# Altium project RT_SUPER_HOST_A.PrjPcb
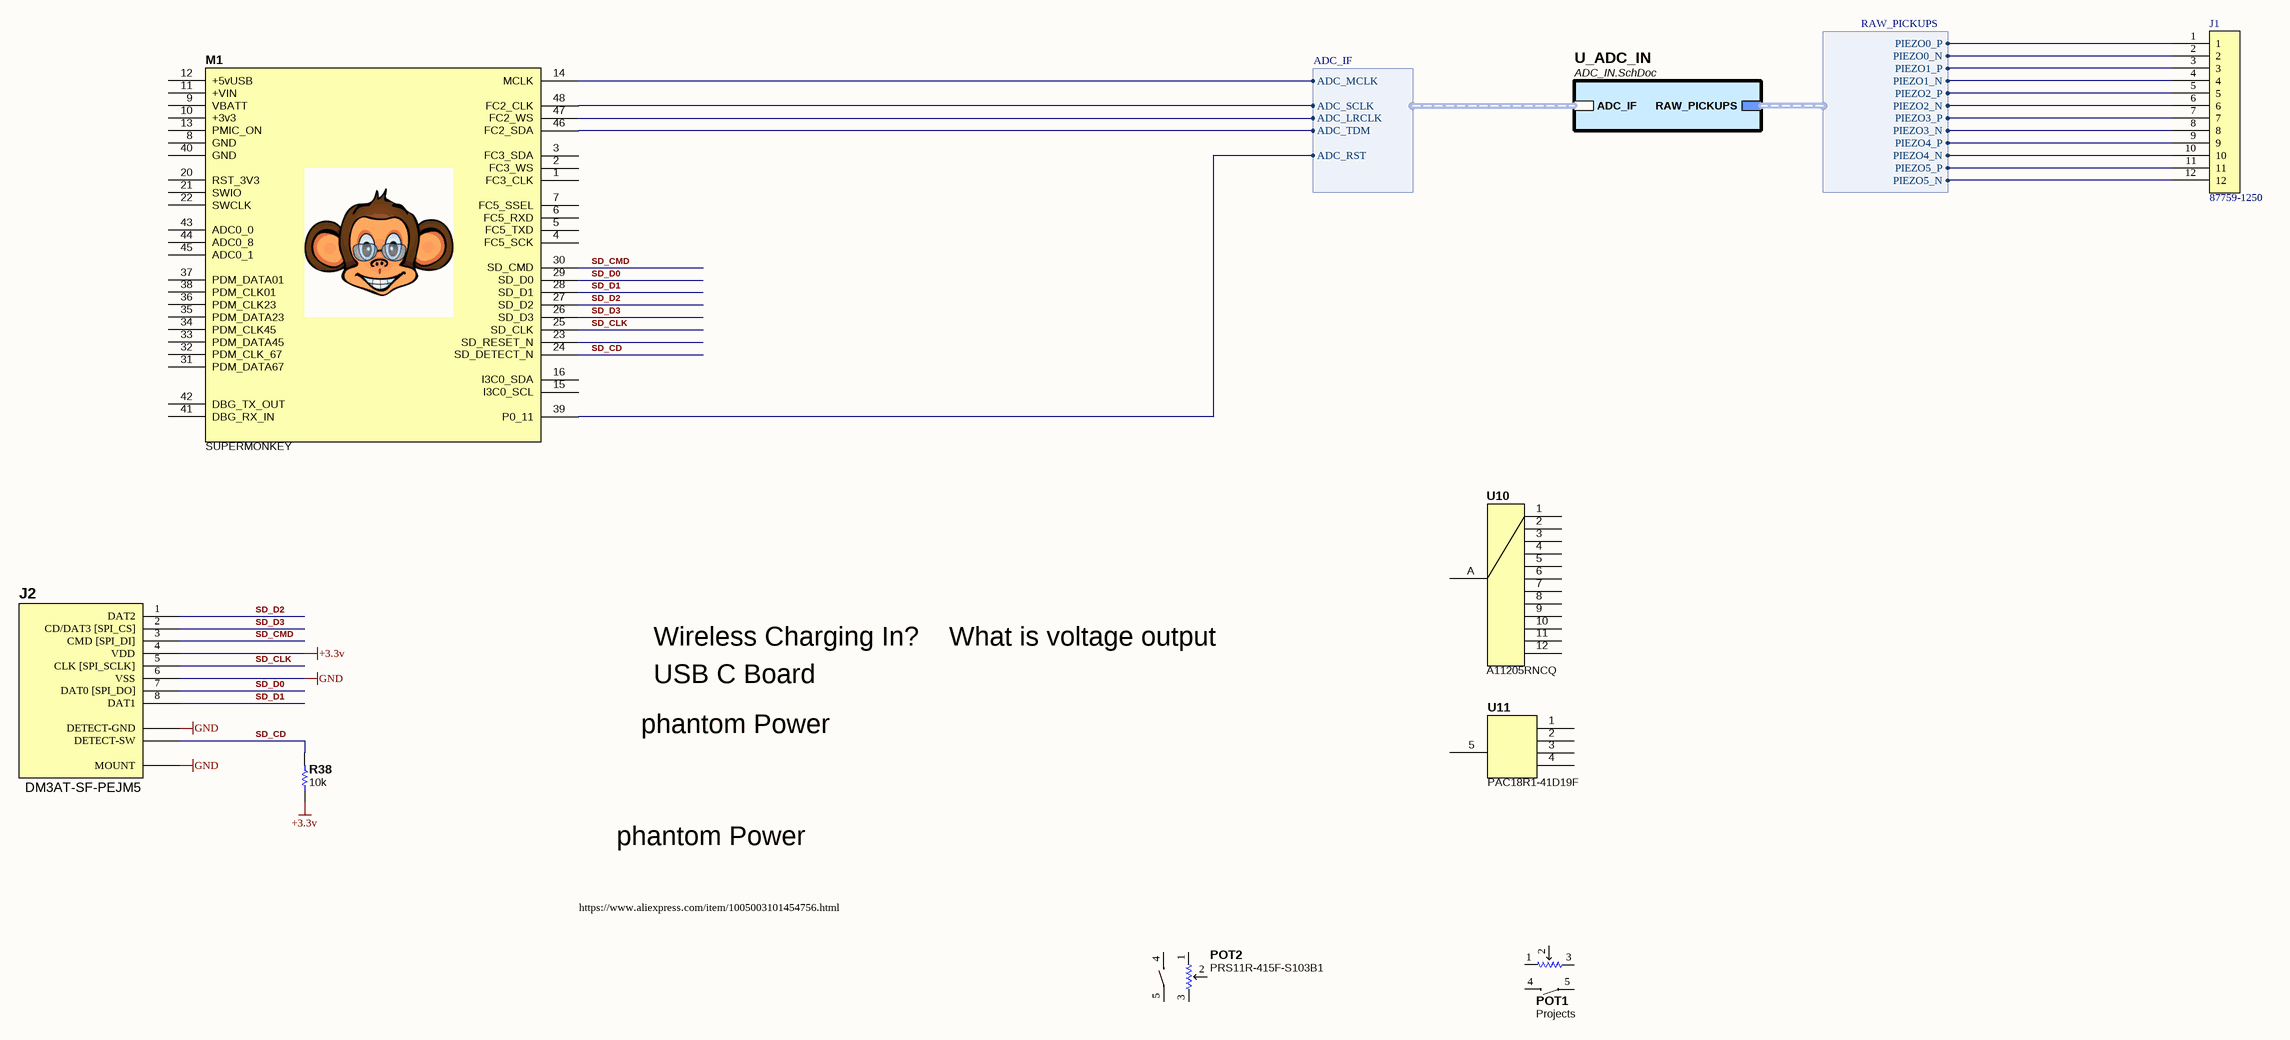
[diagram p0: RT_SUPER_HOST_A.SchDoc]
APPROVAL_APPROVED_1: -; APPROVAL_APPROVED_1_DATE: -; APPROVAL_APPROVED_2: -; APPROVAL_APPROVED_2_DATE: -; APPROVAL_CHECKED_DATE: -; APPROVAL_DRAWN: -; APPROVAL_DRAWN_DATE: -; APPROVAL_ENGINEER: -; APPROVAL_ENGINEER_DATE: -; APPROVAL_REVIEWED: -; APPROVAL_REVIEWED_DATE: -; BOM_NOTES_LINE_1: -; BOM_NOTES_LINE_2: -; BOM_NOTES_LINE_3: -; BOM_NOTES_LINE_4: -; CCA_PART_NUMBER: RT_SUPER; CCA_TITLE: RT_SUPER; PCB_COPPER_WEIGHT_INNER: 1oz; PCB_COPPER_WEIGHT_OUTER: 1oz; PCB_DRC_DATE: X; PCB_FINISH_PLATING: GOLD ENIG; PCB_FINISHED_THICKNESS: 31.25; PCB_LAYERS: 4; PCB_MATERIAL: FR4; PCB_MIN_DRILL: 6; PCB_MIN_TRACE_SPACE: 5; PCB_MIN_TRACE_WIDTH: 5; PCB_PART_NUMBER: RT_SUPER; PCB_PRINTOUT_SCALE: 1:1; PCB_SILKSCREEN_COLOR_BOTTOM: WHITE; PCB_SILKSCREEN_COLOR_TOP: WHITE; PCB_SOLDER_MASK_COLOR_BOTTOM: BLACK; PCB_SOLDER_MASK_COLOR_TOP: BLACK; PCB_TITLE: RT_SUPER; PCB_VERSION: B; PROJECT_ENGINEER: E. Hughes; PROJECT_STATUS: PROTOTYPE; PROJECT_TITLE_LINE_1: RT_SUPER; SCH_DATE: 2021-09-02
2 sheets, 98 parts. Net scope: hierarchical (ports join the sheet entries above them; power ports are global).
Board file: RT_SUPER_HOST_A.PCBdoc
Sheets:
  RT_SUPER_HOST_A.SchDoc
    U_ADC_IN = ADC_IN.SchDoc

## Sheet RT_SUPER_HOST_A.SchDoc
size D; Organization: Altium Limited; Address1: 3 Minna Close; Address2: Belrose; Address3: NSW 2085; Address4: Australia; DocumentNumber: 1; SheetNumber: 1; SheetTotal: 1; PAGE_TITLE: TOP LEVEL

### Parts
J1  87759-1250  [87759-1250]
J2  DM3AT-SF-PEJM5  [DM3AT-SF-PEJM5]
M1  SUPERMONKEY  [SUPERMONKEY]
POT1  Projects  [PRS11R420FS103B1]
POT2  PRS11R-415F-S103B1  [PRS11R415FS103B1]
R38  10k  [R0402_0.40MM_MD]
U10  A11205RNCQ  [A11205RNCQ]
U11  PAC18R1-41D19F  [PAC18R1]

### Sub-sheets
U_ADC_IN = ADC_IN.SchDoc: RAW_PICKUPS (harness RAW_PICKUPS), ADC_IF (harness ADC_IF)

### Harnesses
ADC_IF: ADC_MCLK, ADC_LRCLK, ADC_SCLK, ADC_TDM, ADC_RST
RAW_PICKUPS: PIEZO0_N, PIEZO0_P, PIEZO1_P, PIEZO1_N, PIEZO2_P, PIEZO2_N, PIEZO3_P, PIEZO3_N, PIEZO4_P, PIEZO4_N, PIEZO5_P, PIEZO5_N

### Nets
+3.3v: J2.4(VDD) R38.1
GND: J2.6(VSS) J2.CDA(DETECT-GND) J2.M(MOUNT)
ADC_LRCLK: M1.47(FC2_WS) ; sheet U_ADC_IN/ADC_IF.ADC_LRCLK
ADC_MCLK: M1.14(MCLK) ; sheet U_ADC_IN/ADC_IF.ADC_MCLK
ADC_RST: M1.39(P0_11) ; sheet U_ADC_IN/ADC_IF.ADC_RST
ADC_SCLK: M1.48(FC2_CLK) ; sheet U_ADC_IN/ADC_IF.ADC_SCLK
ADC_TDM: M1.46(FC2_SDA) ; sheet U_ADC_IN/ADC_IF.ADC_TDM
SD_CD: J2.CDB(DETECT-SW) M1.24(SD_DETECT_N) R38.2
SD_CLK: J2.5(CLK_[SPI_SCLK]) M1.25(SD_CLK)
SD_CMD: J2.3(CMD_[SPI_DI]) M1.30(SD_CMD)
SD_D0: J2.7(DAT0_[SPI_DO]) M1.29(SD_D0)
SD_D1: J2.8(DAT1) M1.28(SD_D1)
SD_D2: J2.1(DAT2) M1.27(SD_D2)
SD_D3: J2.2(CD/DAT3_[SPI_CS]) M1.26(SD_D3)
NetJ1_1: J1.1 ; sheet U_ADC_IN/RAW_PICKUPS.PIEZO0_P
NetJ1_2: J1.2 ; sheet U_ADC_IN/RAW_PICKUPS.PIEZO0_N
NetJ1_3: J1.3 ; sheet U_ADC_IN/RAW_PICKUPS.PIEZO1_P
NetJ1_4: J1.4 ; sheet U_ADC_IN/RAW_PICKUPS.PIEZO1_N
NetJ1_5: J1.5 ; sheet U_ADC_IN/RAW_PICKUPS.PIEZO2_P
NetJ1_6: J1.6 ; sheet U_ADC_IN/RAW_PICKUPS.PIEZO2_N
NetJ1_7: J1.7 ; sheet U_ADC_IN/RAW_PICKUPS.PIEZO3_P
NetJ1_8: J1.8 ; sheet U_ADC_IN/RAW_PICKUPS.PIEZO3_N
NetJ1_9: J1.9 ; sheet U_ADC_IN/RAW_PICKUPS.PIEZO4_P
NetJ1_10: J1.10 ; sheet U_ADC_IN/RAW_PICKUPS.PIEZO4_N
NetJ1_11: J1.11 ; sheet U_ADC_IN/RAW_PICKUPS.PIEZO5_P
NetJ1_12: J1.12 ; sheet U_ADC_IN/RAW_PICKUPS.PIEZO5_N

Not connected (* = marked no-connect by the designer): M1 1(FC3_CLK) 2(FC3_WS) 3(FC3_SDA) 4(FC5_SCK) 5(FC5_TXD) 6(FC5_RXD) 7(FC5_SSEL) 8(GND) 9(VBATT) 10(+3v3) 11(+VIN) 12(+5vUSB) 13(PMIC_ON) 15(I3C0_SCL) 16(I3C0_SDA) 20(RST_3V3) 21(SWIO) 22(SWCLK) 23(SD_RESET_N) 31(PDM_DATA67) 32(PDM_CLK_67) 33(PDM_DATA45) 34(PDM_CLK45) 35(PDM_DATA23) 36(PDM_CLK23) 37(PDM_DATA01) 38(PDM_CLK01) 40(GND) 41(DBG_RX_IN) 42(DBG_TX_OUT) 43(ADC0_0) 44(ADC0_8) 45(ADC0_1); POT1 1 2 3 4 5; POT2 1 2 3 4 5; U10 1 2 3 4 5 6 7 8 9 10 11 12 A; U11 1 2 3 4 5

### Notes on the sheet
- Wireless Charging In?    What is voltage output
- USB C Board
- phantom Power
- https://www.aliexpress.com/item/1005003101454756.html
- PCB REV
- CCA REV
- Sheet
- of

### Library data of the parts
J1 = 87759-1250: CONN HEADER 12POS 2MM VERT SMD; Manufacturer: Molex Connector Corporation; Connector Type: Header, Unshrouded; Number of Positions: 12; Number of Positions Loaded: All; Pitch: 0.079" (2.00mm); Value: 87759-1250; Supplier 1: Digi-Key; Supplier Part Number 1: WM18653-ND; Manufacturer Part Number: 87759-1250; RoHS: RoHS Compliant; Category: Connectors, Interconnects; Stock 1: 1595; Pricing 1: 1=2.07, 10=1.823, 100=1.2155, 500=0.9724, 1000=0.80709 (USD); Contact Type: Male Pin; Number of Rows: 2; Row Spacing: 0.079" (2.00mm); Contact Mating Length: 0.150" (3.81mm); Mounting Type: Surface Mount; Termination: Solder; Fastening Type: -; Features: Board Guide; Contact Finish: Gold; Contact Finish Thickness: 15µin (0.38µm); Color: Black; Packaging: Tube; ComponentLink1URL: http://www.molex.com/pdm_docs/sd/877591250_sd.pdf; ComponentLink1Description: http://www.molex.com/pdm_docs/sd/877591250_sd.pdf
J2 = DM3AT-SF-PEJM5: CONN MICRO SD R/A PUSH-PUSH SMD; Manufacturer: Hirose Electric Co Ltd; Card Type: Secure Digital - microSD™; Number of Positions: 10 (8 + 2); Connector Type: Connector and Ejector; Insertion, Removal Method: Push In, Push Out; Supplier 1: Digi-Key; Supplier Part Number 1: HR1964CT-ND; Manufacturer Part Number: DM3AT-SF-PEJM5; RoHS: RoHS Compliant; Category: Connectors, Interconnects; Stock: 28699; Pricing: 1=2.83, 10=2.72, 25=2.4932, 50=2.3798, 100=2.2664, 250=1.98312, 500=1.92648 (USD); Packaging: Cut Tape (CT); Ejector Side: -; Mounting Type: Surface Mount, Right Angle; Features: Switch; Height Above Board: 0.066" (1.68mm); Mounting Feature: Normal, Standard - Top; Contact Finish: Gold; Contact Finish Thickness: -; ComponentLink1URL: http://www.hirose.co.jp/cataloge_hp/e60900232.pdf; ComponentLink1Description: http://www.hirose.co.jp/cataloge_hp/e60900232.pdf; Value: DM3AT-SF-PEJM5
POT1 = PRS11R-420F-S103B1: Manufacturer: Bourns; Manufacturer Part Number: PRS11R-415F-S103B1; Supplier 1: Mouser; Supplier Part Number 1: 652-PRS11R415FS103B1; RoHS: No; Stock 1: 729; Pricing: 1=3.76000, 10=3.30000, 50=3.30000, 100=2.70000, 1000=1.82000, 10000=1.70000 (USD); Value: Projects
POT2 = PRS11R-415F-S103B1: Manufacturer: Bourns; Supplier 1: Mouser; Supplier Part Number 1: 652-PRS11R415FS103B1; Manufacturer Part Number: PRS11R-415F-S103B1; RoHS: No; Stock 1: 729; Pricing: 1=3.76000, 10=3.30000, 50=3.30000, 100=2.70000, 1000=1.82000, 10000=1.70000 (USD); Value: PRS11R-415F-S103B1
R38 = ERJ-2RKF1002X: RES 10K OHM 1/10W 1% 0402 SMD; Manufacturer: Panasonic Electronic Components; Package Power: 0402  (0.1W); Power (Watts): 0.1W- 1/10W; Temperature Coefficient: ±100ppm/°C; Limiting Element Voltage: 50; Maximum Overload Voltage: 100; Maximum Working Voltage: 31.6V; Substitution Notes: 10k , ±1% , 0402 , AEC-Q200; Value: 10k; Manufacturer Part Number: ERJ-2RKF1002X; ComponentLink1Description: Internal Datasheet; ComponentLink1URL: datasheets\Panasonic Electronic Components\AOA0000CE2.pdf; ComponentLink2Description: External Datasheet; ComponentLink2URL: http://industrial.panasonic.com/www-data/pdf/AOA0000/AOA0000CE2.pdf; Supplier 1: Digi-Key; Supplier Part Number 1: P10.0KLCT-ND; Category: Resistors; Resistance (Ohms): 10k; Composition: Thick Film; Features: -; Tolerance: ±1%; Package: 0402 (1005 Metric); Supplier Package: 0402; Size / Dimension: 0.039" L x 0.020" W (1.00mm x 0.50mm); Height: 0.40MM; Number of Terminations: 2; Packaging: Cut Tape (CT); Sort Value: 10000; Sort Value Package: 402_10000; Ratings: AEC-Q200
U10 = A11205RNCQ: Switch Rotary N.O./N.C. SP12T 12 Flatted Shaft PC Pins 2.5A 125VAC 125VDC Automotive; Manufacturer: ITT C&K; Actuator Material: Nylon,Glass; Throw Configuration: SP,SP12T; Number of Positions: 12; Contact Style: Non-Shorting; Voltage Rating (AC): 125V; Number of Decks: 1; Index Angle: 30°; Electrical Life: 300000Cycles; Index Stops: Fixed; Actuator Length: 12.7mm; Supplier 1: Digi-Key; Supplier Part Number 1: CKN6042-ND; Manufacturer Part Number: A11205RNCQ; RoHS: Yes; Category: Rotary Switches; Stock 1: 2149; Pricing: 1=10.02000, 5=8.59800, 10=8.05100, 36=7.38194, 72=6.89514, 108=6.48963, 252=5.94202, 468=5.57701, 972=5.27280 (USD); Mount: Through Hole,Panel; Contact Material: Silver; Contact Plating: Silver; Housing Material: Nylon; Min Operating Temperature: -30°C; Max Operating Temperature: 85°C; Termination: PC Pin; Package Quantity: 1; Max Current Rating: 2.5A; Max Voltage Rating (AC): 125V; Voltage Rating (DC): 125V; Max Voltage Rating (DC): 125V; Current Rating: 2.5A; Number of Poles per Deck: 1; Orientation: Straight; Series: A; Packaging: Bulk; Voltage Rating: 125V; Length: 26.19mm; Depth: 26.19mm; Radiation Hardening: No; Lead Free: Lead Free; RoHS Compliant: Yes; ComponentLink1URL: https://datasheet.ciiva.com/2887/a-rotary-30juyl14-2887303.pdf?src-supplier=Digi-Key; ComponentLink1Description: https://datasheet.ciiva.com/2887/a-rotary-30juyl14-2887303.pdf?src-supplier=Digi-Key; Value: A11205RNCQ
U11 = PAC18R1-41D19F: Manufacturer: Bourns; Supplier 1: Mouser; Supplier Part Number 1: 652-PAC18R1-41D19F; Manufacturer Part Number: PAC18R1-41D19F; RoHS: No; Stock 1: 1877; Pricing: 1=3.26000, 10=3.04000, 50=2.60000, 100=2.45000, 1000=2.00000, 10000=1.91000 (USD); Value: PAC18R1-41D19F

## Sheet ADC_IN.SchDoc
size D
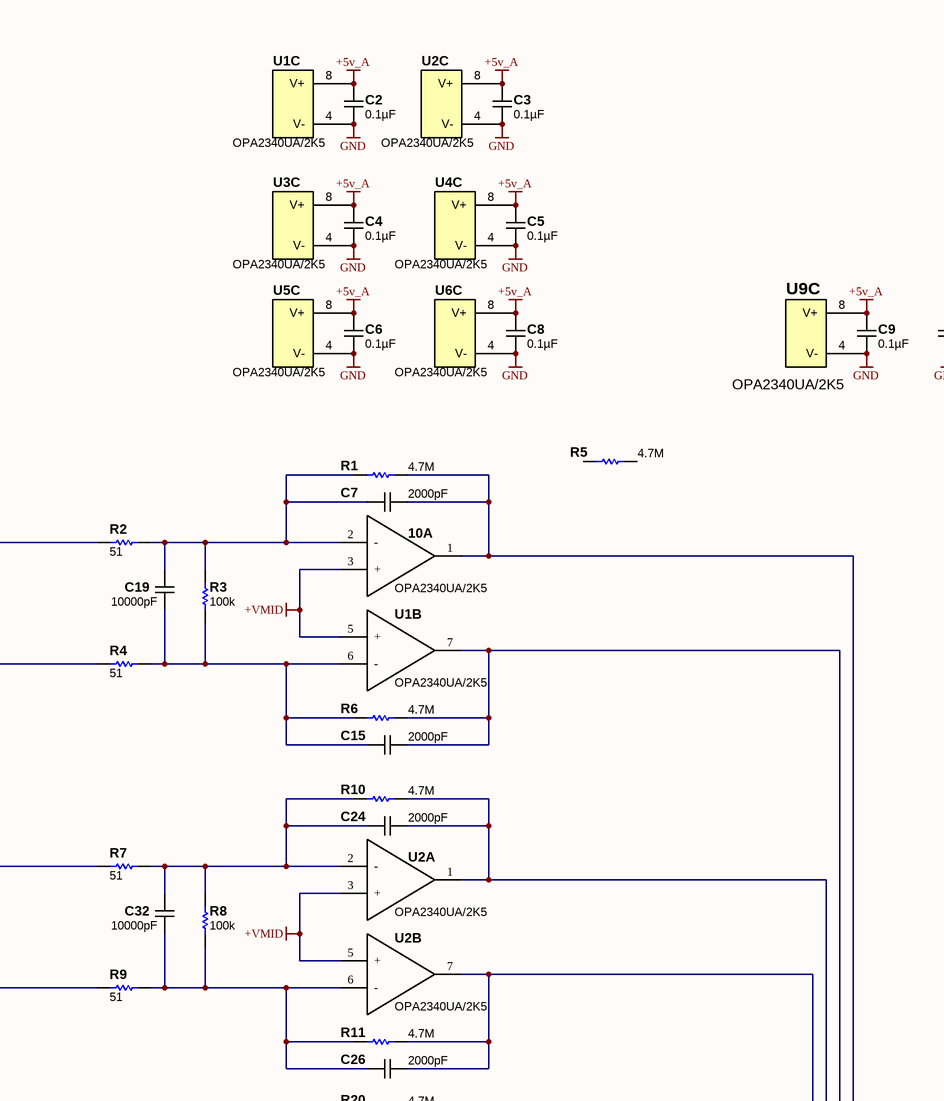
[diagram p1: ADC_IN.SchDoc, top left]
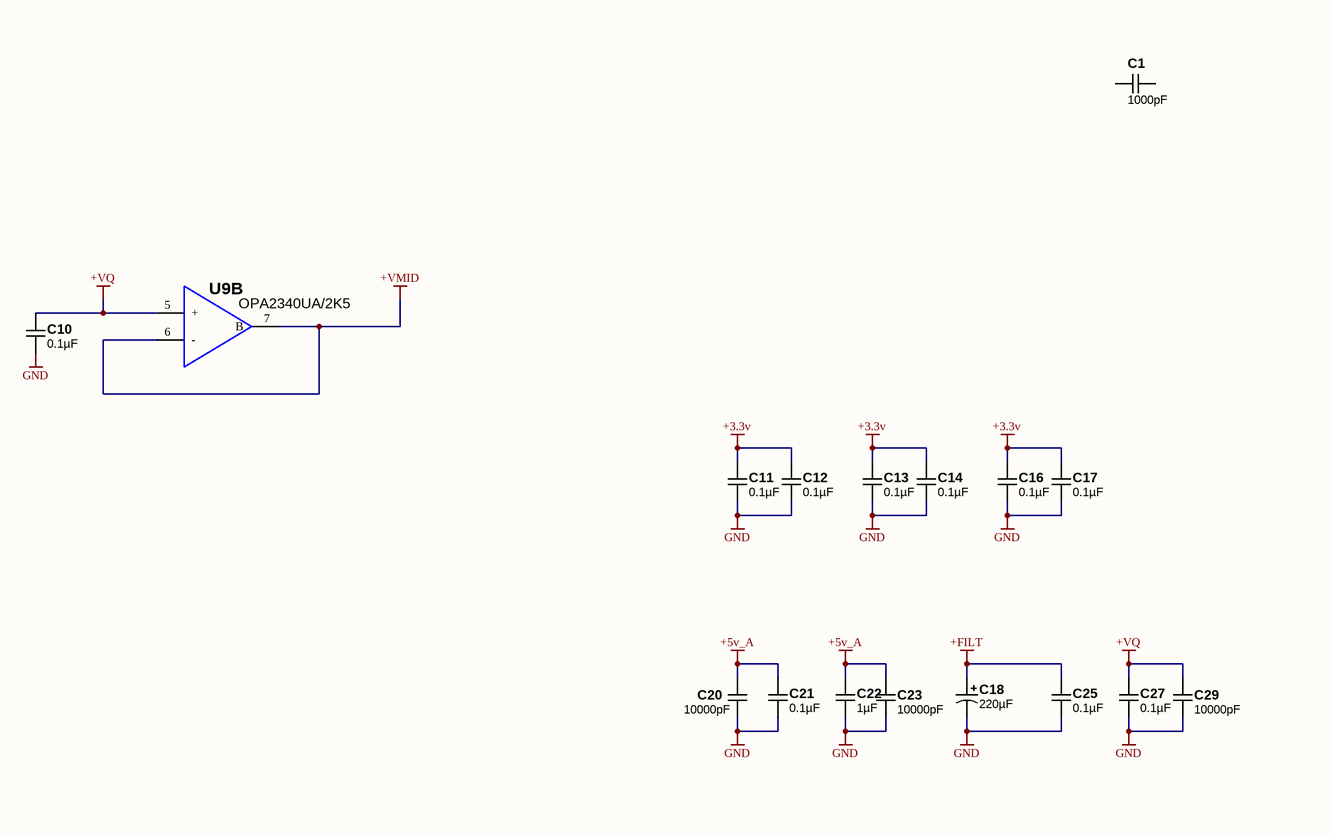
[diagram p2: ADC_IN.SchDoc, top right]
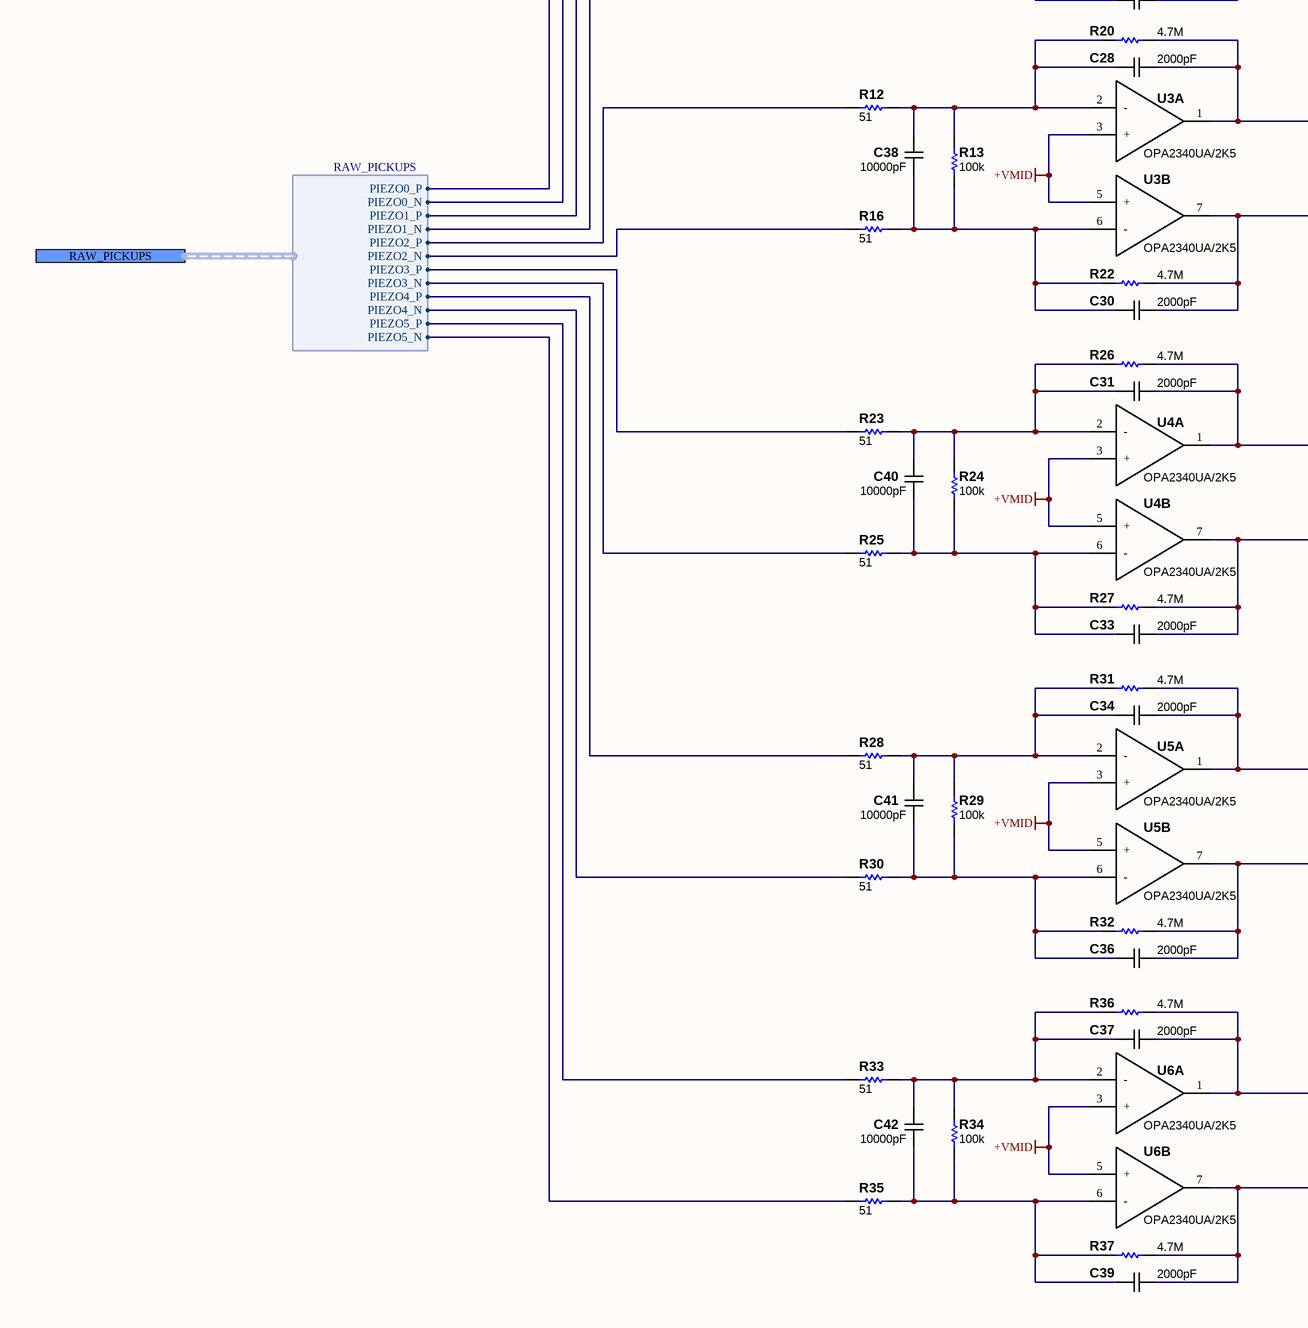
[diagram p3: ADC_IN.SchDoc, bottom left]
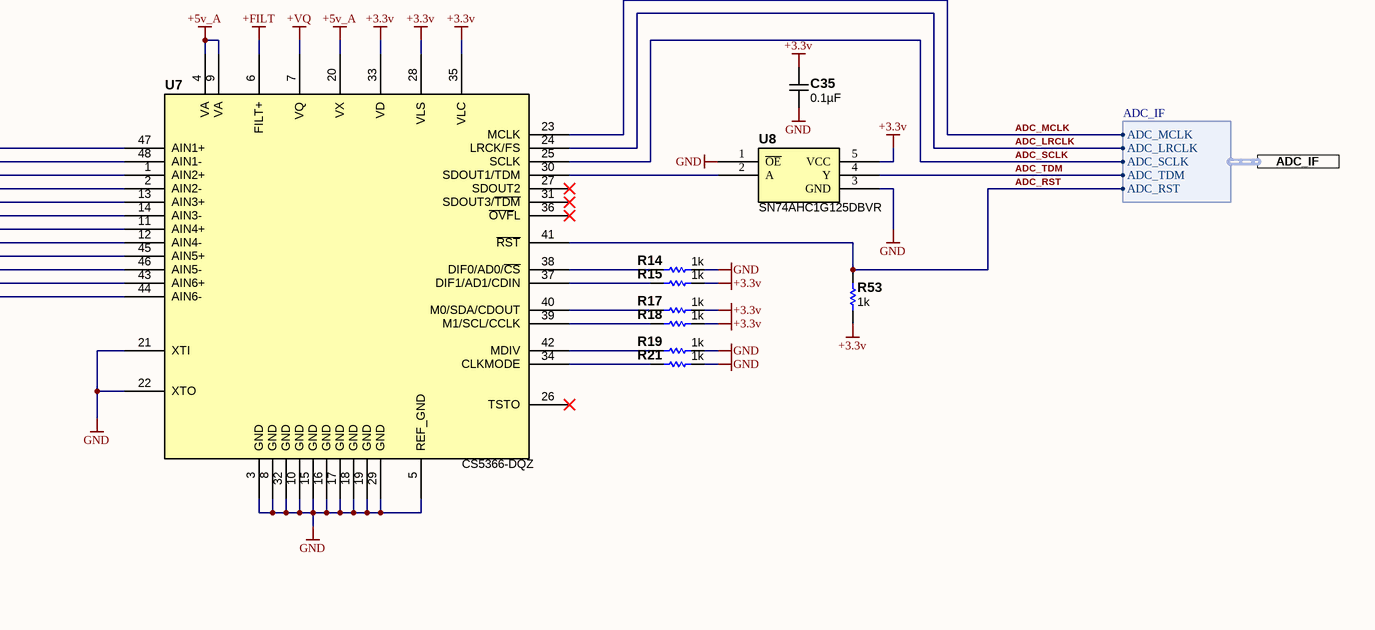
[diagram p4: ADC_IN.SchDoc, bottom right]

### Parts
10  OPA2340UA/2K5  [SOIC 8]  (part A of 3)
C1  1000pF  [C0603_0.90MM_MD]
C2  0.1µF  [C0603_0.90MM_MD]
C3  0.1µF  [C0603_0.90MM_MD]
C4  0.1µF  [C0603_0.90MM_MD]
C5  0.1µF  [C0603_0.90MM_MD]
C6  0.1µF  [C0603_0.90MM_MD]
C7  2000pF  [C0603_MD]
C8  0.1µF  [C0603_0.90MM_MD]
C9  0.1µF  [C0603_0.90MM_MD]
C10  0.1µF  [C0603_0.90MM_MD]
C11  0.1µF  [C0603_0.90MM_MD]
C12  0.1µF  [C0603_0.90MM_MD]
C13  0.1µF  [C0603_0.90MM_MD]
C14  0.1µF  [C0603_0.90MM_MD]
C15  2000pF  [C0603_MD]
C16  0.1µF  [C0603_0.90MM_MD]
C17  0.1µF  [C0603_0.90MM_MD]
C18  220µF  [C_TANT_D_HD]
C19  10000pF  [C0603_0.90MM_MD]
C20  10000pF  [C0603_0.90MM_MD]
C21  0.1µF  [C0603_0.90MM_MD]
C22  1µF  [C0603_0.90MM_MD]
C23  10000pF  [C0603_0.90MM_MD]
C24  2000pF  [C0603_MD]
C25  0.1µF  [C0603_0.90MM_MD]
C26  2000pF  [C0603_MD]
C27  0.1µF  [C0603_0.90MM_MD]
C28  2000pF  [C0603_MD]
C29  10000pF  [C0603_0.90MM_MD]
C30  2000pF  [C0603_MD]
C31  2000pF  [C0603_MD]
C32  10000pF  [C0603_0.90MM_MD]
C33  2000pF  [C0603_MD]
C34  2000pF  [C0603_MD]
C35  0.1µF  [C0603_0.90MM_MD]
C36  2000pF  [C0603_MD]
C37  2000pF  [C0603_MD]
C38  10000pF  [C0603_0.90MM_MD]
C39  2000pF  [C0603_MD]
C40  10000pF  [C0603_0.90MM_MD]
C41  10000pF  [C0603_0.90MM_MD]
C42  10000pF  [C0603_0.90MM_MD]
R1  4.7M  [R0603_MD]
R2  51  [R0603_MD]
R3  100k  [R0603_MD]
R4  51  [R0603_MD]
R5  4.7M  [R0603_MD]
R6  4.7M  [R0603_MD]
R7  51  [R0603_MD]
R8  100k  [R0603_MD]
R9  51  [R0603_MD]
R10  4.7M  [R0603_MD]
R11  4.7M  [R0603_MD]
R12  51  [R0603_MD]
R13  100k  [R0603_MD]
R14  1k  [R0603_MD]
R15  1k  [R0603_MD]
R16  51  [R0603_MD]
R17  1k  [R0603_MD]
R18  1k  [R0603_MD]
R19  1k  [R0603_MD]
R20  4.7M  [R0603_MD]
R21  1k  [R0603_MD]
R22  4.7M  [R0603_MD]
R23  51  [R0603_MD]
R24  100k  [R0603_MD]
R25  51  [R0603_MD]
R26  4.7M  [R0603_MD]
R27  4.7M  [R0603_MD]
R28  51  [R0603_MD]
R29  100k  [R0603_MD]
R30  51  [R0603_MD]
R31  4.7M  [R0603_MD]
R32  4.7M  [R0603_MD]
R33  51  [R0603_MD]
R34  100k  [R0603_MD]
R35  51  [R0603_MD]
R36  4.7M  [R0603_MD]
R37  4.7M  [R0603_MD]
R53  1k  [R0603_MD]
U1  OPA2340UA/2K5  [SOIC 8]  (parts B,C of 3)
U2  OPA2340UA/2K5  [SOIC 8]  (parts A,B,C of 3)
U3  OPA2340UA/2K5  [SOIC 8]  (parts A,B,C of 3)
U4  OPA2340UA/2K5  [SOIC 8]  (parts A,B,C of 3)
U5  OPA2340UA/2K5  [SOIC 8]  (parts A,B,C of 3)
U6  OPA2340UA/2K5  [SOIC 8]  (parts A,B,C of 3)
U7  CS5366-DQZ  [TSQFP50P900X900X145-48L]
U8  SN74AHC1G125DBVR  [SOT23-5]
U9  OPA2340UA/2K5  [SOIC 8]  (parts B,C of 3)

### Ports
ADC_IF (harness ADC_IF), RAW_PICKUPS (harness RAW_PICKUPS)

### Harnesses
RAW_PICKUPS: PIEZO0_N, PIEZO0_P, PIEZO1_P, PIEZO1_N, PIEZO2_P, PIEZO2_N, PIEZO3_P, PIEZO3_N, PIEZO4_P, PIEZO4_N, PIEZO5_P, PIEZO5_N
ADC_IF: ADC_MCLK, ADC_LRCLK, ADC_SCLK, ADC_TDM, ADC_RST

### Nets
+3.3v: C11.2 C12.2 C13.2 C14.2 C16.2 C17.2 C35.2 R15.1 R17.1 R18.1 R53.1 U7.28(VLS) U7.33(VD) U7.35(VLC) U8.5(VCC)
+5v_A: C2.2 C3.2 C4.2 C5.2 C6.2 C8.2 C9.2 C20.2 C21.2 C22.2 C23.1 U1.8(V+) U2.8(V+) U3.8(V+) U4.8(V+) U5.8(V+) U6.8(V+) U7.4(VA) U7.9(VA) U7.20(VX) U9.8(V+)
+FILT: C18.1 C25.2 U7.6(FILT+)
+VMID: 10.3(+) U1.5(+) U2.3(+) U2.5(+) U3.3(+) U3.5(+) U4.3(+) U4.5(+) U5.3(+) U5.5(+) U6.3(+) U6.5(+) U9.6(-) U9.7(B)
+VQ: C10.2 C27.2 C29.1 U7.7(VQ) U9.5(+)
GND: C2.1 C3.1 C4.1 C5.1 C6.1 C8.1 C9.1 C10.1 C11.1 C12.1 C13.1 C14.1 C16.1 C17.1 C18.2 C20.1 C21.1 C22.1 C23.2 C25.1 C27.1 C29.2 C35.1 R14.1 R19.1 R21.1 U1.4(V-) U2.4(V-) U3.4(V-) U4.4(V-) U5.4(V-) U6.4(V-) U7.3(GND) U7.5(REF_GND) U7.8(GND) U7.10(GND) U7.15(GND) U7.16(GND) U7.17(GND) U7.18(GND) U7.19(GND) U7.21(XTI) U7.22(XTO) U7.29(GND) U7.32(GND) U8.1(~{OE}) U8.3(GND) U9.4(V-)
ADC_LRCLK: U7.24(LRCK/FS) ; port ADC_IF.ADC_LRCLK
ADC_MCLK: U7.23(MCLK) ; port ADC_IF.ADC_MCLK
ADC_RST: R53.2 U7.41(~{RST}) ; port ADC_IF.ADC_RST
ADC_SCLK: U7.25(SCLK) ; port ADC_IF.ADC_SCLK
ADC_TDM: U8.4(Y) ; port ADC_IF.ADC_TDM
Net10_1: 10.1(A) C7.2 R1.2 U7.43(AIN6+)
Net10_2: 10.2(-) C7.1 C19.2 R1.1 R2.2 R3.2
NetC15_1: C15.1 C19.1 R3.1 R4.2 R6.1 U1.6(-)
NetC15_2: C15.2 R6.2 U1.7(B) U7.44(AIN6-)
NetC24_1: C24.1 C32.2 R7.2 R8.2 R10.1 U2.2(-)
NetC24_2: C24.2 R10.2 U2.1(A) U7.45(AIN5+)
NetC26_1: C26.1 C32.1 R8.1 R9.2 R11.1 U2.6(-)
NetC26_2: C26.2 R11.2 U2.7(B) U7.46(AIN5-)
NetC28_1: C28.1 C38.2 R12.2 R13.2 R20.1 U3.2(-)
NetC28_2: C28.2 R20.2 U3.1(A) U7.47(AIN1+)
NetC30_1: C30.1 C38.1 R13.1 R16.2 R22.1 U3.6(-)
NetC30_2: C30.2 R22.2 U3.7(B) U7.48(AIN1-)
NetC31_1: C31.1 C40.2 R23.2 R24.2 R26.1 U4.2(-)
NetC31_2: C31.2 R26.2 U4.1(A) U7.1(AIN2+)
NetC33_1: C33.1 C40.1 R24.1 R25.2 R27.1 U4.6(-)
NetC33_2: C33.2 R27.2 U4.7(B) U7.2(AIN2-)
NetC34_1: C34.1 C41.2 R28.2 R29.2 R31.1 U5.2(-)
NetC34_2: C34.2 R31.2 U5.1(A) U7.11(AIN4+)
NetC36_1: C36.1 C41.1 R29.1 R30.2 R32.1 U5.6(-)
NetC36_2: C36.2 R32.2 U5.7(B) U7.12(AIN4-)
NetC37_1: C37.1 C42.2 R33.2 R34.2 R36.1 U6.2(-)
NetC37_2: C37.2 R36.2 U6.1(A) U7.13(AIN3+)
NetC39_1: C39.1 C42.1 R34.1 R35.2 R37.1 U6.6(-)
NetC39_2: C39.2 R37.2 U6.7(B) U7.14(AIN3-)
NetJ1_1: R2.1 ; port RAW_PICKUPS.PIEZO0_P
NetJ1_2: R4.1 ; port RAW_PICKUPS.PIEZO0_N
NetJ1_3: R7.1 ; port RAW_PICKUPS.PIEZO1_P
NetJ1_4: R9.1 ; port RAW_PICKUPS.PIEZO1_N
NetJ1_5: R12.1 ; port RAW_PICKUPS.PIEZO2_P
NetJ1_6: R16.1 ; port RAW_PICKUPS.PIEZO2_N
NetJ1_7: R23.1 ; port RAW_PICKUPS.PIEZO3_P
NetJ1_8: R25.1 ; port RAW_PICKUPS.PIEZO3_N
NetJ1_9: R28.1 ; port RAW_PICKUPS.PIEZO4_P
NetJ1_10: R30.1 ; port RAW_PICKUPS.PIEZO4_N
NetJ1_11: R33.1 ; port RAW_PICKUPS.PIEZO5_P
NetJ1_12: R35.1 ; port RAW_PICKUPS.PIEZO5_N
NetR14_2: R14.2 U7.38(DIF0/AD0/~{CS})
NetR15_2: R15.2 U7.37(DIF1/AD1/CDIN)
NetR17_2: R17.2 U7.40(M0/SDA/CDOUT)
NetR18_2: R18.2 U7.39(M1/SCL/CCLK)
NetR19_2: R19.2 U7.42(MDIV)
NetR21_2: R21.2 U7.34(CLKMODE)
NetU7_30: U7.30(SDOUT1/TDM) U8.2(A)

Not connected (* = marked no-connect by the designer): C1 1 2(1); R5 1 2; U7 26(TSTO)* 27(SDOUT2)* 31(SDOUT3/~{TDM})* 36(~{OVF}L)*

### Notes on the sheet
- Title
- Size:
- Date:
- File:
- D
- Number:
- Time:
- Revision:
- Sheet
- of

### Library data of the parts
10 U1-U6 U9 = OPA2340UA/2K5: IC OPAMP GP 5.5MHZ RRO 8SOIC; Manufacturer: Texas Instruments; Amplifier Type: General Purpose; Number of Circuits: 2; Output Type: Rail-to-Rail; Slew Rate: 6 V/µs; Current - Input Bias: 0.2pA; Voltage - Input Offset: 150µV; Current - Supply: 750µA; Current - Output / Channel: 50mA; Voltage - Supply, Single/Dual (±): 2.5 V ~ 5.5 V; Value: OPA2340UA/2K5; Supplier 1: Digi-Key; Supplier Part Number 1: 296-26254-1-ND; Manufacturer Part Number: OPA2340UA/2K5; RoHS: RoHS Compliant; Category: Integrated Circuits (ICs); Stock 1: 1425; Pricing 1: 1=3.51, 10=3.148, 25=2.8304, 100=2.5742, 250=2.3302, 500=2.0862, 750=1.891, 1000=1.7568 (USD); Packaging: Cut Tape (CT); Gain Bandwidth Product: 5.5MHz; -3db Bandwidth: -; Operating Temperature: -40°C ~ 85°C; Mounting Type: Surface Mount; Package / Case: 8-SOIC (0.154", 3.90mm Width); Supplier Device Package: 8-SOIC; ComponentLink1URL: http://www.ti.com/lit/ds/symlink/opa2340.pdf; ComponentLink1Description: http://www.ti.com/lit/ds/symlink/opa2340.pdf
C1 = CL10C102FB8NNNC: CAP CER 1000PF 50V C0G/NP0 0603; Manufacturer: Samsung Electro-Mechanics; Temperature Coefficient: C0G, NP0; Tolerance: ±1%; Substitution Notes: 1000pF , 50V , ±1% , C0G, NP0 , -55°C ~ 125°C,0603; Value: 1000pF; Manufacturer Part Number: CL10C102FB8NNNC; ComponentLink1Description: Datasheet (Internal); ComponentLink1URL: datasheets\Samsung\CL05B153KB5VPNC.pdf.pdf; ComponentLink2Description: Datasheet (External); ComponentLink2URL: http://www.samsungsem.com/kr/support/product-search/mlcc/__icsFiles/afieldfile/2017/05/25/CL05B153KB5VPNC.pdf; Supplier 1: Digikey; Supplier Part Number 1: 1276-6824-1-ND; Category: Capacitors; Voltage - Rated: 50V; Operating Temperature: -55°C ~ 125°C; Ratings: -; Package: 0603; Thickness (Max): 0.90MM
C2-C6 C8-C14 C16 C17 C21 C25 C27 C35 = CGA3E2X7R1H104K080AA: CAP CER 0.1UF 50V X7R 0603; Manufacturer: TDK Corporation; Tolerance: ±10%; Substitution Notes: 0.1µF , 50V , ±10% , X7R , -55°C ~ 125°C , AEC-Q200 , 0603; Value: 0.1µF; Temperature Coefficient: X7R; Manufacturer Part Number: CGA3E2X7R1H104K080AA; ComponentLink1Description: Datasheet (Internal); ComponentLink1URL: datasheets\TDK\mlcc_automotive_general_en.pdf; ComponentLink2Description: Datasheet (External); ComponentLink2URL: https://product.tdk.com/info/en/catalog/datasheets/mlcc_automotive_general_en.pdf; Supplier 1: Digikey; Supplier Part Number 1: 445-5666-1-ND; Category: Capacitors; Voltage - Rated: 50V; Features: -; Operating Temperature: -55°C ~ 125°C; Ratings: AEC-Q200; Package: 0603; Thickness (Max): 0.90MM
C7 C15 C24 C26 C28 C30 C31 C33 C34 C36 C37 C39 = GRM1885C1H202JA01D: CAP CER 2000PF 50V 5% NP0 0603; Manufacturer: Murata Electronics North America; Temperature Coefficient: C0G- NP0; Value: 2000pF; Manufacturer Part Number: GRM1885C1H202JA01D; ComponentLink1Description: \\altium.sil.arl.psu.edu\Libraries\datasheets\Murata Electronics North America\GRM1885C1H202JA01%23.pdf; ComponentLink1URL: http://search.murata.co.jp/Ceramy/image/img/A01X/G101/ENG/GRM1555C1HR60WA01-01.pdf; ComponentLink2Description: External Datasheet; ComponentLink2URL: http://psearch.murata.com/capacitor/product/GRM1885C1H202JA01%23.pdf; Stocked: 0; Supplier 1: Digi-Key; Supplier Part Number 1: 490-1458-1-ND; Category: Capacitors; Sort Value: 2000; Sort Value Package: 0603_2000; Pricing: 1 = 0.13  ;  10 = 0.09  ;  50 = 0.0518  ;  100 = 0.0428  ;  250 = 0.036  ;  500 = 0.03016  ;  1000 = 0.02475 (USD); Sales Status: Active; Capacitance: 2000pF; Voltage - Rated: 50V; Tolerance: ±5%; Mounting Type: Surface Mount- MLCC; Operating Temperature: -55°C ~ 125°C; Applications: General Purpose; Ratings: -; Package: 0603 (1608 Metric); Size / Dimension: 0.063" L x 0.031" W (1.60mm x 0.80mm); Height - Seated (Max): -; Thickness (Max): 0.035" (0.90mm); Lead Spacing: -; Features: -; Packaging: Cut Tape (CT); Lead Style: -; Supplier Package: 0603; Thickness: 90; Value_Voltage: 2000pF  50V
C18 = T495D227K010ATE125: CAP TANT 220UF 10V 10% 2917; Manufacturer: Kemet; ESR (Equivalent Series Resistance): 125 mOhm; Type: Molded; F40: T; Value_Voltage: 220µF  10V  125 mOhm; Value: 220µF; Temperature Coefficient: Temperature Coefficient; Manufacturer Part Number: T495D227K010ATE125; ComponentLink1Description: Internal Datasheet; ComponentLink1URL: http://www.kemet.com/datasheets&T495D227K010ATE125; ComponentLink2Description: External Datasheet; ComponentLink2URL: http://www.kemet.com/datasheets&T495D227K010ATE125; Stocked: 0; Supplier 1: Digi-Key; Supplier Part Number 1: 399-3881-1-ND; Category: Capacitors; Sort Value: 220000000; Sort Value Package: D_220000000; Pricing: 1 = 1.68  ;  10 = 1.329  ;  50 = 1.1518  ;  100 = 0.9968  ;  250 = 0.886 (USD); Sales Status: Active; Capacitance: 220µF; Voltage - Rated: 10V; Tolerance: ±10%; Operating Temperature: -55°C ~ 125°C; Mounting Type: Surface Mount; Package: 2917 (7343 Metric); Size / Dimension: 0.287" L x 0.169" W (7.30mm x 4.30mm); Height - Seated (Max): 0.122" (3.10mm); Lead Spacing: -; Supplier Package: D; Features: General Purpose; Packaging: Cut Tape (CT); Lifetime @ Temp#: -
C19 C20 C23 C29 C32 C38 C40-C42 = CGA3E2X7R1H103K080AA: CAP CER 10000PF 50V X7R 0603; Manufacturer: TDK Corporation; Tolerance: ±10%; Substitution Notes: 10000pF , 50V , ±10% , X7R , -55°C ~ 125°C , AEC-Q200 , 0603; Value: 10000pF; Temperature Coefficient: X7R; Manufacturer Part Number: CGA3E2X7R1H103K080AA; ComponentLink1Description: Datasheet (Internal); ComponentLink1URL: datasheets\TDK\mlcc_automotive_general_en.pdf; ComponentLink2Description: Datasheet (External); ComponentLink2URL: https://product.tdk.com/info/en/catalog/datasheets/mlcc_automotive_general_en.pdf; Supplier 1: Digikey; Supplier Part Number 1: 445-5662-1-ND; Category: Capacitors; Voltage - Rated: 50V; Features: -; Operating Temperature: -55°C ~ 125°C; Ratings: AEC-Q200; Package: 0603; Thickness (Max): 0.90MM
C22 = CGA3E1X7R1E105K080AC: CAP CER 1UF 25V X7R 0603; Manufacturer: TDK Corporation; Tolerance: ±10%; Substitution Notes: 1µF , 25V , ±10% , X7R , -55°C ~ 125°C , AEC-Q200 , 0603; Value: 1µF; Temperature Coefficient: X7R; Manufacturer Part Number: CGA3E1X7R1E105K080AC; ComponentLink1Description: Datasheet (Internal); ComponentLink1URL: datasheets\TDK\mlcc_automotive_general_en.pdf; ComponentLink2Description: Datasheet (External); ComponentLink2URL: https://product.tdk.com/info/en/catalog/datasheets/mlcc_automotive_general_en.pdf; Supplier 1: Digikey; Supplier Part Number 1: 445-6931-1-ND; Category: Capacitors; Voltage - Rated: 25V; Features: -; Operating Temperature: -55°C ~ 125°C; Ratings: AEC-Q200; Package: 0603; Thickness (Max): 0.90MM
R1 R5 R6 R10 R11 R20 R22 R26 R27 R31 R32 R36 R37 = RC0603FR-074M7L: RES SMD 4.7M OHM 1% 1/10W 0603; Manufacturer: Yageo; Power Rating: 100mW; Voltage Rating: 50V; Resistance: 4.7MR; Temperature Coefficient: 100ppm/°C; Value: 4.7M; Supplier 1: Digi-Key; Supplier Part Number 1: 311-4.70MHRCT-ND; Manufacturer Part Number: RC0603FR-074M7L; Stock 1: 774342; Pricing 1: 1=0.1, 10=0.015, 100=0.006, 1000=0.00268, 2500=0.00233 (USD); Case/Package: 0603; Number of Pins: 2; Case Code (Imperial): 0603; Case Code (Metric): 1608; Min Operating Temperature: -55°C; Max Operating Temperature: 155°C; Tolerance: 1%; Voltage Rating (DC): 50V; Packaging: Tape and Reel; Termination: SMD/SMT; Composition: Thick Film; Military Standard: Not; Length: 1.6mm; Height: 0.45mm; Width: 0.8mm; Depth: 0.8mm; REACH SVHC: No SVHC; Lead Free: Lead Free; ComponentLink1URL: https://datasheet.ciiva.com/11819/0900766b80f96399-11819362.pdf; ComponentLink1Description: https://datasheet.ciiva.com/11819/0900766b80f96399-11819362.pdf; ComponentLink2URL: https://datasheet.ciiva.com/15189/getdatasheetpartid-328863-15189765.pdf; ComponentLink2Description: https://datasheet.ciiva.com/15189/getdatasheetpartid-328863-15189765.pdf; ComponentLink3URL: https://datasheet.ciiva.com/7746/443971-7746367.pdf; ComponentLink3Description: https://datasheet.ciiva.com/7746/443971-7746367.pdf
R2 R4 R7 R9 R12 R16 R23 R25 R28 R30 R33 R35 = ERJ-3EKF51R0V: RES 51 OHM 1/10W 1% 0603 SMD; Manufacturer: Panasonic Electronic Components; Package Power: 0603  (0.1W); Power (Watts): 0.1W- 1/10W; Temperature Coefficient: ±100ppm/°C; Limiting Element Voltage: 75; Maximum Overload Voltage: 150; Maximum Working Voltage: 2.3V; Value: 51; Manufacturer Part Number: ERJ-3EKF51R0V; ComponentLink1Description: Internal Datasheet; ComponentLink1URL: \\altium.sil.arl.psu.edu\Libraries\datasheets\Panasonic Electronic Components\AOA0000CE2.pdf; ComponentLink2Description: External Datasheet; ComponentLink2URL: http://industrial.panasonic.com/www-data/pdf/AOA0000/AOA0000CE2.pdf; Stocked: 0; Supplier 1: Digi-Key; Supplier Part Number 1: P51.0HCT-ND; Category: Resistors; Resistance (Ohms): 51; Composition: Thick Film; Features: -; Tolerance: ±1%; Package: 0603 (1608 Metric); Supplier Package: 603; Size / Dimension: 0.063" L x 0.031" W (1.60mm x 0.80mm); Height: 0.022" (0.55mm); Number of Terminations: 2; Packaging: Cut Tape (CT); Sort Value: 51; Sort Value Package: 603_51
R3 R8 R13 R24 R29 R34 = ERJ-3EKF1003V: RES 100K OHM 1/10W 1% 0603 SMD; Manufacturer: Panasonic Electronic Components; Package Power: 0603  (0.1W); Power (Watts): 0.1W- 1/10W; Temperature Coefficient: ±100ppm/°C; Limiting Element Voltage: 75; Maximum Overload Voltage: 150; Maximum Working Voltage: 75.0V; Value: 100k; Manufacturer Part Number: ERJ-3EKF1003V; ComponentLink1Description: Internal Datasheet; ComponentLink1URL: \\altium.sil.arl.psu.edu\Libraries\datasheets\Panasonic Electronic Components\AOA0000CE2.pdf; ComponentLink2Description: External Datasheet; ComponentLink2URL: http://industrial.panasonic.com/www-data/pdf/AOA0000/AOA0000CE2.pdf; Stocked: 0; Supplier 1: Digi-Key; Supplier Part Number 1: P100KHCT-ND; Category: Resistors; Resistance (Ohms): 100k; Composition: Thick Film; Features: -; Tolerance: ±1%; Package: 0603 (1608 Metric); Supplier Package: 603; Size / Dimension: 0.063" L x 0.031" W (1.60mm x 0.80mm); Height: 0.022" (0.55mm); Number of Terminations: 2; Packaging: Cut Tape (CT); Sort Value: 100000; Sort Value Package: 603_100000
R14 R15 R17-R19 R21 R53 = ERJ-3EKF1001V: RES 1K OHM 1/10W 1% 0603 SMD; Manufacturer: Panasonic Electronic Components; Package Power: 0603  (0.1W); Power (Watts): 0.1W- 1/10W; Temperature Coefficient: ±100ppm/°C; Limiting Element Voltage: 75; Maximum Overload Voltage: 150; Maximum Working Voltage: 10.0V; Value: 1k; Manufacturer Part Number: ERJ-3EKF1001V; ComponentLink1Description: Internal Datasheet; ComponentLink1URL: \\altium.sil.arl.psu.edu\Libraries\datasheets\Panasonic Electronic Components\AOA0000CE2.pdf; ComponentLink2Description: External Datasheet; ComponentLink2URL: http://industrial.panasonic.com/www-data/pdf/AOA0000/AOA0000CE2.pdf; Stocked: 0; Supplier 1: Digi-Key; Supplier Part Number 1: P1.00KHCT-ND; Category: Resistors; Resistance (Ohms): 1k; Composition: Thick Film; Features: -; Tolerance: ±1%; Package: 0603 (1608 Metric); Supplier Package: 603; Size / Dimension: 0.063" L x 0.031" W (1.60mm x 0.80mm); Height: 0.022" (0.55mm); Number of Terminations: 2; Packaging: Cut Tape (CT); Sort Value: 1000; Sort Value Package: 603_1000
U7 = CS5366-DQZ: Audio A/D Converter ICs 114dB 192kHz 6-Ch ADC w/TDM Interface; Manufacturer: Cirrus Logic; Number of Converters: 1; Resolution: 24 bit; Conversion Rate: 192 kS/s; SNR: No; Number of ADC Inputs: 6; Operating Supply Voltage: 5 V; Supply Voltage - Max: 5.25 V; Supply Voltage - Min: 4.75 V; Value: CS5366-DQZ; Supplier 1: Mouser; Supplier Part Number 1: 777-CS5366-DQZ; Manufacturer Part Number: CS5366-DQZ; RoHS: RoHS Compliant; Category: Audio A/D Converter ICs; Stock 1: 0; Pricing 1: 168=20.52, 250=18.89, 500=17.91 (AUD); Package / Case: LQFP-48; Packaging: Tube; Series: CS5366; Brand: Cirrus Logic; Mounting Style: SMD/SMT; Maximum Operating Temperature: + 105 C; Minimum Operating Temperature: - 40 C; Product Category: Converters - Analog to Digital (ADC); Standard Pack Qty: 250; Tradename: CS5366; RoHS - Mouser: Y; Minimum Order Quantity: 168; Reeling: False; ComponentLink1URL: http://www.mouser.com/ds/2/76/CirrusLogic_CS5366_F5-356671.pdf; ComponentLink1Description: http://www.mouser.com/ds/2/76/CirrusLogic_CS5366_F5-356671.pdf
U8 = SN74AHC1G125DBVR: IC BUS BUFF TRI-ST N-INV SOT235; Manufacturer: Texas Instruments; Logic Type: Buffer/Line Driver, Non-Inverting; Number of Elements: 1; Current - Output High, Low: 8mA, 8mA; Voltage - Supply: 2 V ~ 5.5 V; Supplier 1: Digi-Key; Supplier Part Number 1: 296-8744-1-ND; Manufacturer Part Number: SN74AHC1G125DBVR; RoHS: RoHS Compliant; Category: Integrated Circuits (ICs); Stock 1: 40446; Pricing 1: 1=0.53, 25=0.31, 100=0.25, 250=0.18, 500=0.145, 1000=0.1125 (USD); Number of Bits per Element: 1; Operating Temperature: -40°C ~ 85°C; Mounting Type: Surface Mount; Package / Case: SC-74A, SOT-753; Supplier Device Package: SOT-23-5; Packaging: Cut Tape (CT); ComponentLink1URL: http://www.ti.com/lit/ds/symlink/sn74ahc1g125.pdf; ComponentLink1Description: http://www.ti.com/lit/ds/symlink/sn74ahc1g125.pdf; Value: SN74AHC1G125DBVR

## Nets that join several sheets
+3.3v: RT_SUPER_HOST_A (J2.4 R38.1), ADC_IN (15 pins)
GND: RT_SUPER_HOST_A (J2.6 J2.CDA J2.M), ADC_IN (48 pins)
ADC_LRCLK: RT_SUPER_HOST_A (M1.47), ADC_IN (U7.24)
ADC_MCLK: RT_SUPER_HOST_A (M1.14), ADC_IN (U7.23)
ADC_RST: RT_SUPER_HOST_A (M1.39), ADC_IN (R53.2 U7.41)
ADC_SCLK: RT_SUPER_HOST_A (M1.48), ADC_IN (U7.25)
ADC_TDM: RT_SUPER_HOST_A (M1.46), ADC_IN (U8.4)
NetJ1_1: RT_SUPER_HOST_A (J1.1), ADC_IN (R2.1)
NetJ1_2: RT_SUPER_HOST_A (J1.2), ADC_IN (R4.1)
NetJ1_3: RT_SUPER_HOST_A (J1.3), ADC_IN (R7.1)
NetJ1_4: RT_SUPER_HOST_A (J1.4), ADC_IN (R9.1)
NetJ1_5: RT_SUPER_HOST_A (J1.5), ADC_IN (R12.1)
NetJ1_6: RT_SUPER_HOST_A (J1.6), ADC_IN (R16.1)
NetJ1_7: RT_SUPER_HOST_A (J1.7), ADC_IN (R23.1)
NetJ1_8: RT_SUPER_HOST_A (J1.8), ADC_IN (R25.1)
NetJ1_9: RT_SUPER_HOST_A (J1.9), ADC_IN (R28.1)
NetJ1_10: RT_SUPER_HOST_A (J1.10), ADC_IN (R30.1)
NetJ1_11: RT_SUPER_HOST_A (J1.11), ADC_IN (R33.1)
NetJ1_12: RT_SUPER_HOST_A (J1.12), ADC_IN (R35.1)

## Assembly variants
B: all parts fitted